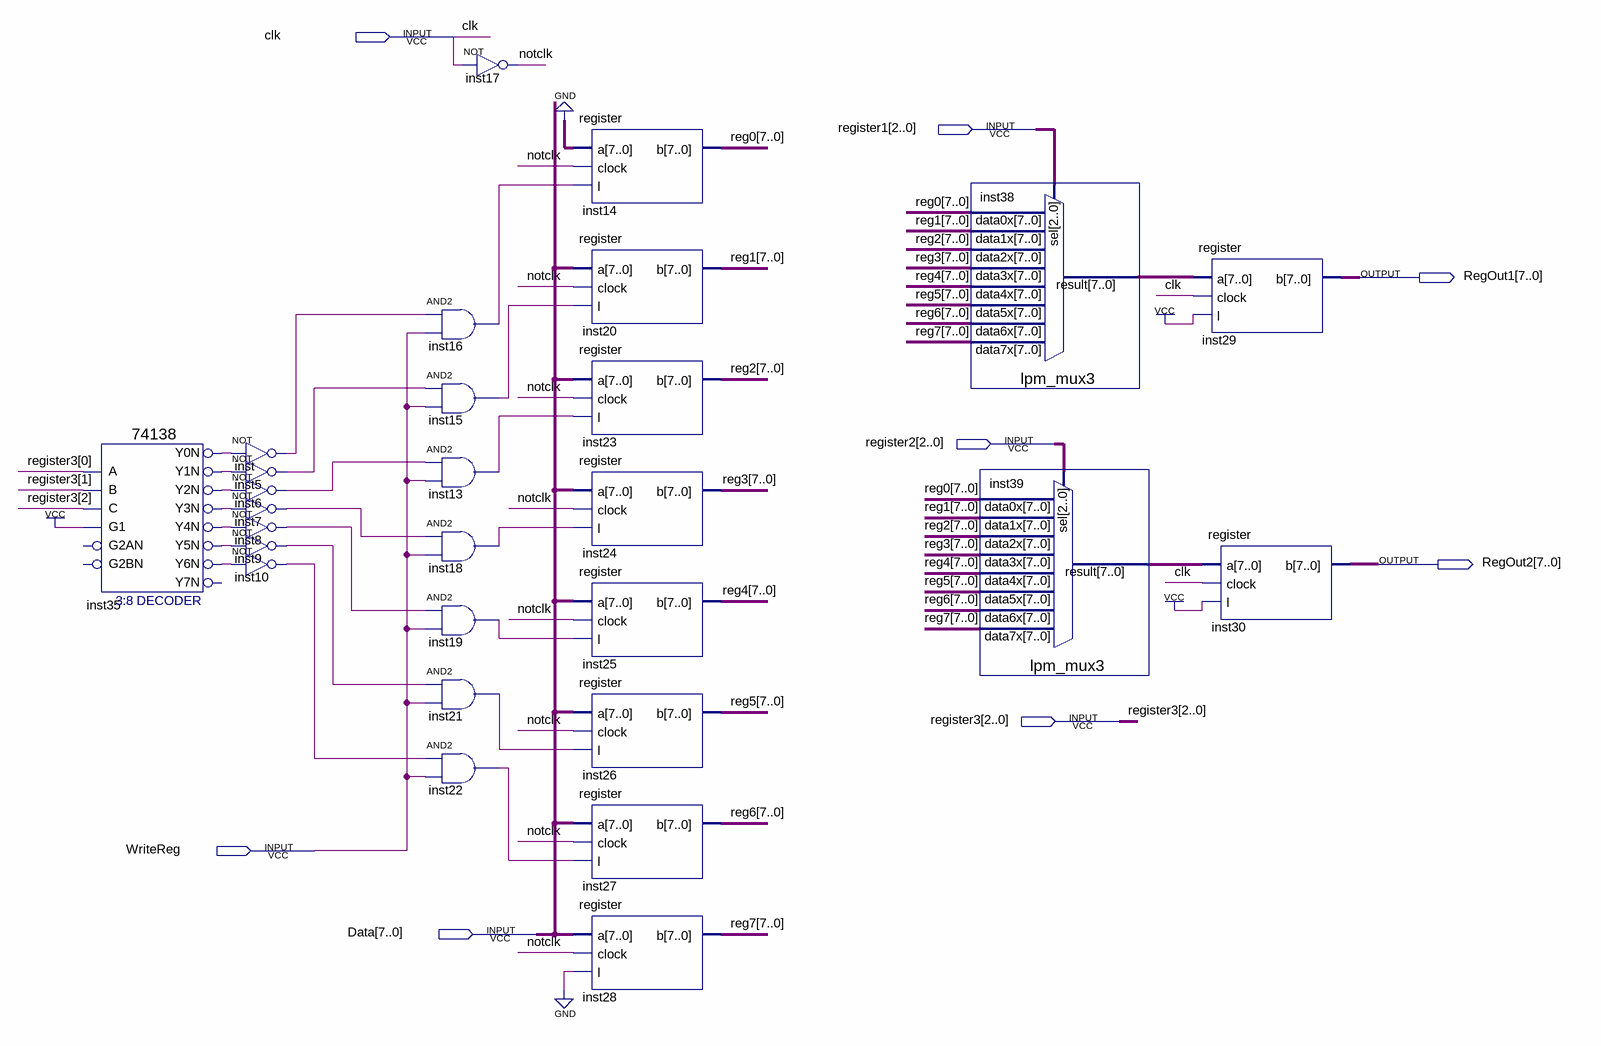
[diagram p0: schematic sheet]
// Quartus schematic registerfile.bdf as structural Verilog: 28 symbols, 8 pins
module registerfile (
  input  clk,
  input  [2:0] register1,
  input  [2:0] register2,
  input  [2:0] register3,
  input  WriteReg,
  input  [7:0] Data,
  output [7:0] RegOut1,
  output [7:0] RegOut2
);

  wire inst5_out, inst6_out, inst7_out, inst8_out, inst9_out, inst10_out, inst13_out, inst15_out, inst16_out,
       inst18_out, inst19_out, inst21_out, inst22_out, inst35_y0n, inst35_y1n, inst35_y2n, inst35_y3n,
       inst35_y4n, inst35_y5n, inst35_y6n, inst_out, notclk;
  wire [7:0] inst38_result, inst39_result, reg0, reg1, reg2, reg3, reg4, reg5, reg6, reg7;

  \74138  inst35 (
    .A(register3[0]), .B(register3[1]), .G1(1'b1), .C(register3[2]), .Y0N(inst35_y0n), .Y1N(inst35_y1n),
    .Y2N(inst35_y2n), .Y3N(inst35_y3n), .Y4N(inst35_y4n), .Y5N(inst35_y5n), .Y6N(inst35_y6n));  // open: G2AN, G2BN, Y7N
  not inst (inst_out, inst35_y0n);
  not inst5 (inst5_out, inst35_y1n);
  not inst6 (inst6_out, inst35_y2n);
  not inst7 (inst7_out, inst35_y3n);
  not inst8 (inst8_out, inst35_y4n);
  not inst9 (inst9_out, inst35_y5n);
  not inst10 (inst10_out, inst35_y6n);
  not inst17 (notclk, clk);
  and inst16 (inst16_out, inst_out, WriteReg);
  and inst15 (inst15_out, inst5_out, WriteReg);
  and inst13 (inst13_out, inst6_out, WriteReg);
  and inst18 (inst18_out, inst7_out, WriteReg);
  and inst19 (inst19_out, inst8_out, WriteReg);
  and inst21 (inst21_out, inst9_out, WriteReg);
  and inst22 (inst22_out, inst10_out, WriteReg);
  register inst14 (.a({8{1'b0}}), .clock(notclk), .l(inst16_out), .b(reg0));
  register inst20 (.a(Data), .clock(notclk), .l(inst15_out), .b(reg1));
  register inst23 (.a(Data), .clock(notclk), .l(inst13_out), .b(reg2));
  register inst24 (.a(Data), .clock(notclk), .l(inst18_out), .b(reg3));
  register inst25 (.a(Data), .clock(notclk), .l(inst19_out), .b(reg4));
  register inst26 (.a(Data), .clock(notclk), .l(inst21_out), .b(reg5));
  register inst27 (.a(Data), .clock(notclk), .l(inst22_out), .b(reg6));
  register inst28 (.a(Data), .clock(notclk), .l(1'b0), .b(reg7));
  lpm_mux3 inst38 (
    .data7x(reg7), .data6x(reg6), .data5x(reg5), .data4x(reg4), .data3x(reg3), .data2x(reg2), .data1x(reg1),
    .data0x(reg0), .sel(register1), .result(inst38_result));
  lpm_mux3 inst39 (
    .data7x(reg7), .data6x(reg6), .data5x(reg5), .data4x(reg4), .data3x(reg3), .data2x(reg2), .data1x(reg1),
    .data0x(reg0), .sel(register2), .result(inst39_result));
  register inst29 (.a(inst38_result), .clock(clk), .l(1'b1), .b(RegOut1));
  register inst30 (.a(inst39_result), .clock(clk), .l(1'b1), .b(RegOut2));
endmodule
